# Altium schematic sheet Powerboard Rev01.SchDoc: Power Board
size 431 x 279 mm; Date: 02/07/2023; ApprovedBy: moose lmao; CheckedBy: Moooose; Author: Eric; CompanyName: MBD; DrawnBy: Eric; Engineer: Eric; Organization: MBD; DocumentNumber: 01; Revision: 01; SheetNumber: 1; SheetTotal: 1
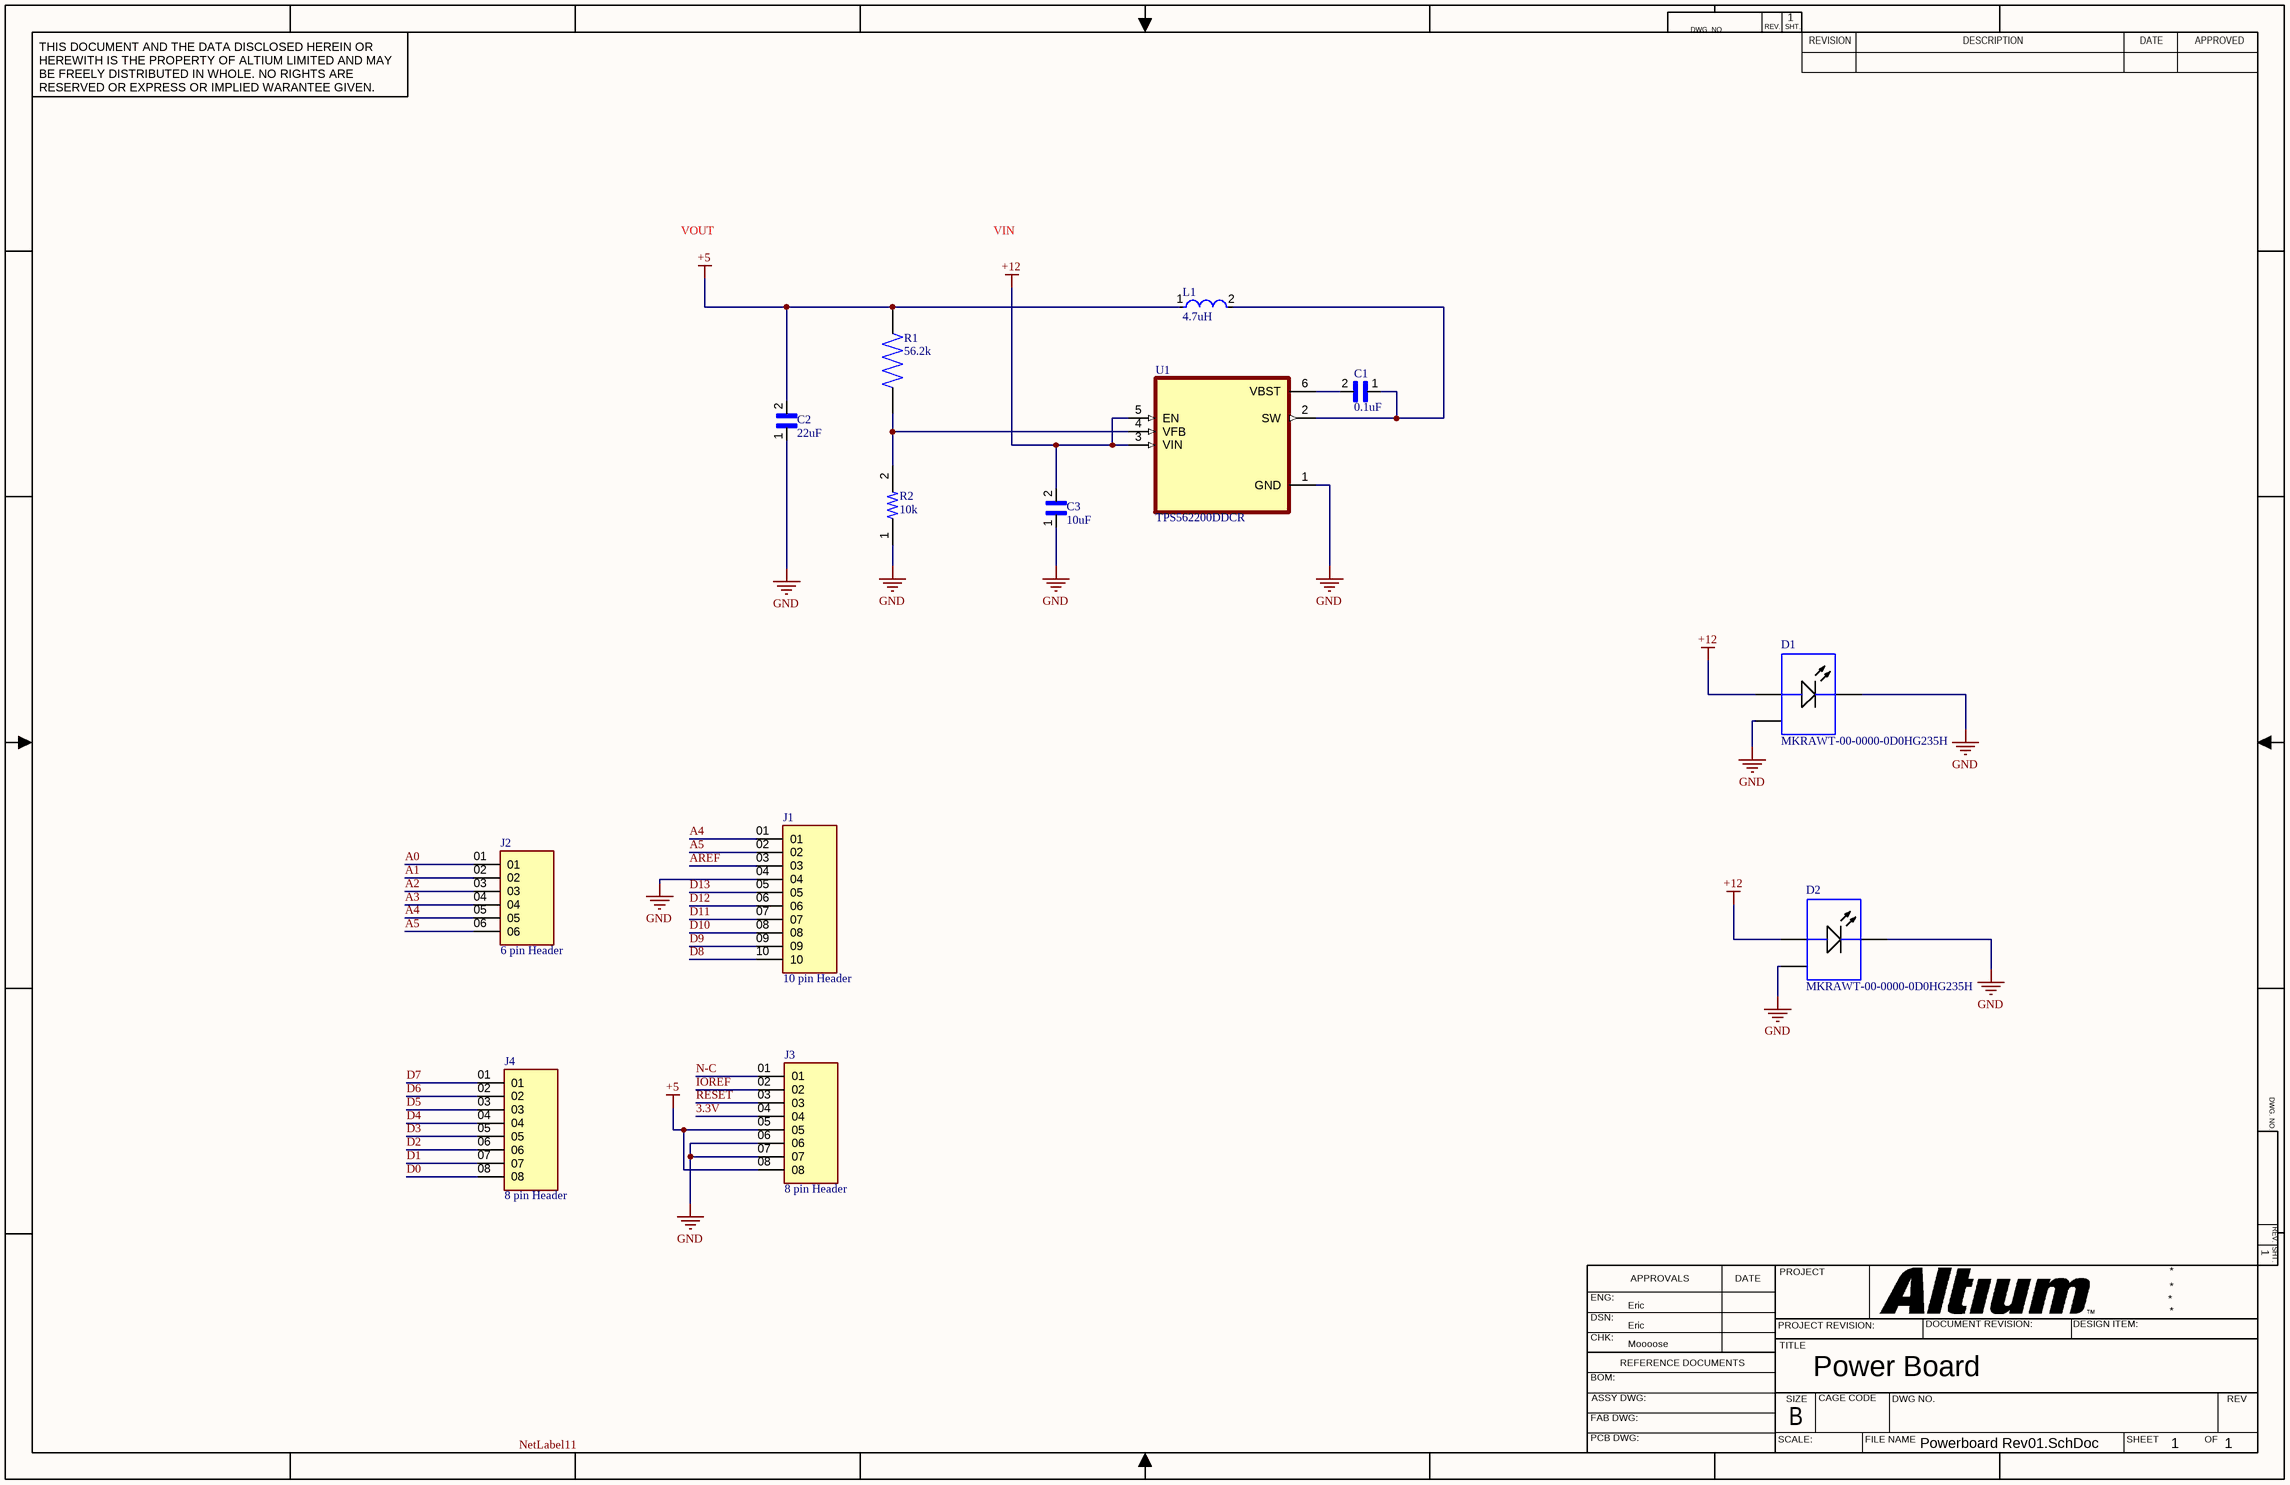
[diagram p0: Powerboard Rev01.SchDoc]

## Parts
C1  0.1uF  [CAPC2012X94N]
C2  22uF  [CAPC1608X100N]
C3  10uF  [CAPC2012X100N]
D1  MKRAWT-00-0000-0D0HG235H  [CREE-MK-R-2_V]
D2  MKRAWT-00-0000-0D0HG235H  [CREE-MK-R-2_V]
J1  10 pin Header  [SAMTEC_SSQ-110-03-X-S]
J2  6 pin Header  [SAMTEC_SSQ-106-03-X-S]
J3  8 pin Header  [SAMTEC_SSQ-108-03-X-S]
J4  8 pin Header  [SAMTEC_SSQ-108-03-X-S]
L1  4.7uH  [FP-NR5040-H_4_1-MFG]
R1  56.2k  [RESC0603X26N]
R2  10k  [RESC0603X26N]
U1  TPS562200DDCR  [SOT95P280X110-6N]

## Nets
+5: C2.2 J3.05 J3.08 L1.1 R1.2
+12: C3.2 D1.1(A) D2.1(A) U1.3(VIN) U1.5(EN)
GND: C2.1 C3.1 D1.2(K) D1.3(EP) D2.2(K) D2.3(EP) J1.04 J3.06 J3.07 R2.1 U1.1(GND)
3.3V: J3.04
A0: J2.01
A1: J2.02
A2: J2.03
A3: J2.04
A4: J1.01 J2.05
A5: J1.02 J2.06
AREF: J1.03
D0: J4.08
D1: J4.07
D2: J4.06
D3: J4.05
D4: J4.04
D5: J4.03
D6: J4.02
D7: J4.01
D8: J1.10
D9: J1.09
D10: J1.08
D11: J1.07
D12: J1.06
D13: J1.05
IOREF: J3.02
N-C: J3.01
RESET: J3.03
NetC1_1: C1.1 L1.2 U1.2(SW)
NetC1_2: C1.2 U1.6(VBST)
NetR1_1: R1.1 R2.2 U1.4(VFB)

## Notes on the sheet
- VOUT
- VIN
- Labels drawn without touching a wire or pin: NetLabel11
- DWG. NO.
- REV.
- SHT.
- THIS DOCUMENT AND THE DATA DISCLOSED HEREIN OR HEREWITH IS THE PROPERTY OF ALTIUM LIMITED AND MAY BE FREELY DISTRIBUTED IN WHOLE. NO RIGHTS ARE RESERVED OR EXPRESS OR IMPLIED WARANTEE GIVEN.
- REVISION
- DESCRIPTION
- DATE
- APPROVED
- ENG:
- APPROVALS
- PROJECT
- DSN:
- CHK:
- REFERENCE DOCUMENTS
- PROJECT REVISION:
- TITLE
- DOCUMENT REVISION:
- DESIGN ITEM:
- BOM:
- FAB DWG:
- PCB DWG:
- ASSY DWG:
- SCALE:
- SIZE
- B
- CAGE CODE
- FILE NAME
- DWG NO.
- SHEET
- OF
- REV

## Library data of the parts
C1 = 08053C104KAT2A: 08053C104KAT2A Cap Ceramic 0.1uF 25V X7R 10% Pad SMD 0805 125ÂÂŽ T/R; MF: {'manufacturer': u'AVX Interconnect / Elco'}; MP: 08053C104KAT2A; Price: None; Availability: Unavailable; Value: *; Package: None
C2 = C1608X5R1A226M080AC: C1608X5R1A226M080AC 22µF ±20% 10V Ceramic Capacitor X5R 0603 (1608 Metric); MF: {'manufacturer': u'TDK'}; Value: *; Price: None; Availability: Unavailable; Package: None; MP: C1608X5R1A226M080AC
C3 = C2012X5R1V106K085AC: C2012X5R1V106K085AC 10µF ±10% 35V Ceramic Capacitor X5R 0805 (2012 Metric); MF: {'manufacturer': u'TDK'}; Value: *; Price: None; Availability: Unavailable; Package: None; MP: C2012X5R1V106K085AC
D1 D2 = CMP-2100-00977-1: LED, White, 12 V, 2-Pin SMD, RoHS, Tape and Reel
J1 = SSQ-110-03-X-S: SSQ-110-03-X-S 10 Position Receptacle Connector Through Hole; MF: {'manufacturer': u'Samtec'}; MP: SSQ-110-03-X-S; Price: None; Availability: Unavailable; Value: *; Package: None
J2 = SSQ-106-03-X-S: SSQ-106-03-X-S 6 Position Receptacle Connector Through Hole; MF: {'manufacturer': u'Samtec Inc.'}; Value: *; Price: None; Availability: Unavailable; Package: None; MP: SSQ-106-03-X-S
J3 J4 = SSQ-108-03-X-S: MF: {'manufacturer': u'Samtec'}; Value: *; Price: None; Availability: Unavailable; Package: None; MP: SSQ-108-03-X-S
L1 = CMP-14484-001014-1: NR5040T4R7N SMD Power Inductors 4.7uH ±30% 3.1A 37.7mΩ; Test Frequency: 100kHz; Self Resonant Frequency: 28MHz; DC Resistance (DCR): 37.7mR; Saturation Current: 3.3A; Shielding: Shielded; Core Material: Ferrite; Package Quantity: 1500; RoHS Compliant: Yes; Resistor Type: Wirewound; Width: 4.9mm; Termination: SMD/SMT; Number of Pins: 2; Current Rating: 3.1A; Depth: 5.1mm; RMS Current (Irms): 3.1A; Height - Seated (Max): 0.161inch; Height: 4mm; Packaging: Tape and Reel; Inductance: 4.7uH; Length: 0.193inch; Max DC Current: 3.3A; Inductance Tolerance: 30%; Case/Package: Nonstandard; Series: NR; Min Operating Temperature: -25°C; Max Operating Temperature: 120°C; Mount: Surface Mount; Radiation Hardening: No; Tolerance: 30%; Halogen Free: Halogen Free
R1 = RC0201FR-0756K2L: RC0201FR-0756K2L RES SMD 56.2K OHM 1% 1/20W 0201; MF: {'manufacturer': u'Yageo'}; MP: RC0201FR-0756K2L; Price: None; Availability: Unavailable; Value: *; Package: None
R2 = RC0201FR-0710KL: RC0201FR-0710KL  10.0K 1% 0.05W TK200; MF: {'manufacturer': u'Yageo'}; MP: RC0201FR-0710KL; Price: None; Availability: Unavailable; Value: *; Package: None
U1 = TPS562200DDCR: MF: {'manufacturer': u'Texas Instruments'}; Availability: Unavailable; MP: TPS562200DDCR; Package: None; Price: None; Value: *